# Altium schematic sheet 16-BitSWStatusLed.SchDoc
size A4
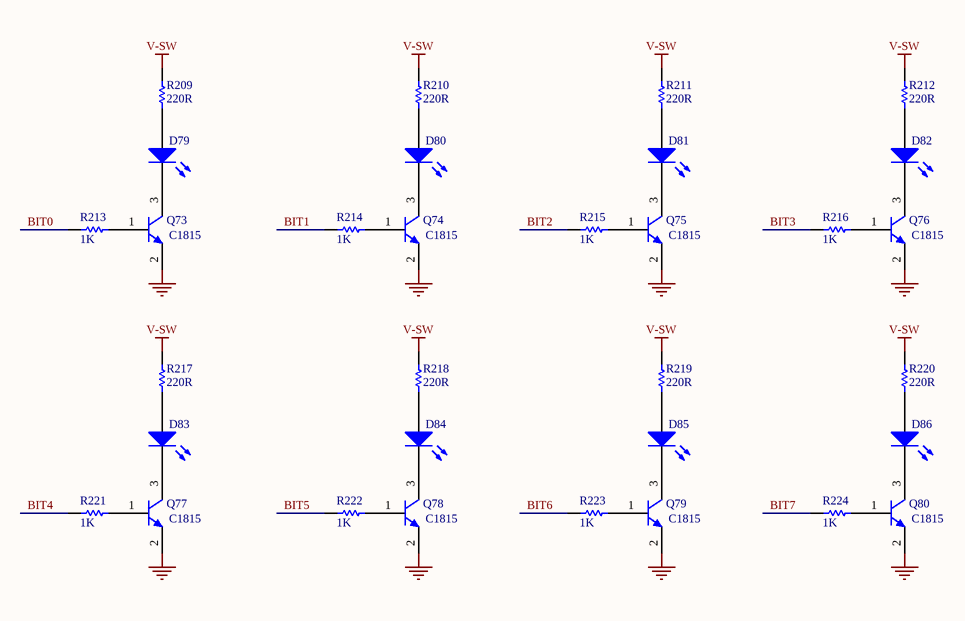
[diagram p0: 16-BitSWStatusLed.SchDoc]

## Parts
D79  LED  [LED-3528]  (value not drawn)
D80  LED  [LED-3528]  (value not drawn)
D81  LED  [LED-3528]  (value not drawn)
D82  LED  [LED-3528]  (value not drawn)
D83  LED  [LED-3528]  (value not drawn)
D84  LED  [LED-3528]  (value not drawn)
D85  LED  [LED-3528]  (value not drawn)
D86  LED  [LED-3528]  (value not drawn)
Q73  value C1815  [SOT23-321]  (hidden comment: C1815-SMD)
Q74  value C1815  [SOT23-321]  (hidden comment: C1815-SMD)
Q75  value C1815  [SOT23-321]  (hidden comment: C1815-SMD)
Q76  value C1815  [SOT23-321]  (hidden comment: C1815-SMD)
Q77  value C1815  [SOT23-321]  (hidden comment: C1815-SMD)
Q78  value C1815  [SOT23-321]  (hidden comment: C1815-SMD)
Q79  value C1815  [SOT23-321]  (hidden comment: C1815-SMD)
Q80  value C1815  [SOT23-321]  (hidden comment: C1815-SMD)
R209  value 220R  [R-0805]  (hidden comment: 221)
R210  value 220R  [R-0805]  (hidden comment: 221)
R211  value 220R  [R-0805]  (hidden comment: 221)
R212  value 220R  [R-0805]  (hidden comment: 221)
R213  1K  [R-0805]
R214  1K  [R-0805]
R215  1K  [R-0805]
R216  1K  [R-0805]
R217  value 220R  [R-0805]  (hidden comment: 221)
R218  value 220R  [R-0805]  (hidden comment: 221)
R219  value 220R  [R-0805]  (hidden comment: 221)
R220  value 220R  [R-0805]  (hidden comment: 221)
R221  1K  [R-0805]
R222  1K  [R-0805]
R223  1K  [R-0805]
R224  1K  [R-0805]

## Nets
GND: Q73.2(E) Q74.2(E) Q75.2(E) Q76.2(E) Q77.2(E) Q78.2(E) Q79.2(E) Q80.2(E)
V-SW: R209.2 R210.2 R211.2 R212.2 R217.2 R218.2 R219.2 R220.2
BIT0: R213.2
BIT1: R214.2
BIT2: R215.2
BIT3: R216.2
BIT4: R221.2
BIT5: R222.2
BIT6: R223.2
BIT7: R224.2
NetD79_1: D79.1(A) R209.1
NetD79_2: D79.2(K) Q73.3(C)
NetD80_1: D80.1(A) R210.1
NetD80_2: D80.2(K) Q74.3(C)
NetD81_1: D81.1(A) R211.1
NetD81_2: D81.2(K) Q75.3(C)
NetD82_1: D82.1(A) R212.1
NetD82_2: D82.2(K) Q76.3(C)
NetD83_1: D83.1(A) R217.1
NetD83_2: D83.2(K) Q77.3(C)
NetD84_1: D84.1(A) R218.1
NetD84_2: D84.2(K) Q78.3(C)
NetD85_1: D85.1(A) R219.1
NetD85_2: D85.2(K) Q79.3(C)
NetD86_1: D86.1(A) R220.1
NetD86_2: D86.2(K) Q80.3(C)
NetQ73_1: Q73.1(B) R213.1
NetQ74_1: Q74.1(B) R214.1
NetQ75_1: Q75.1(B) R215.1
NetQ76_1: Q76.1(B) R216.1
NetQ77_1: Q77.1(B) R221.1
NetQ78_1: Q78.1(B) R222.1
NetQ79_1: Q79.1(B) R223.1
NetQ80_1: Q80.1(B) R224.1

## Library data of the parts
D79-D86 = LED2: Typical RED, GREEN, YELLOW, AMBER GaAs LED; Published: 8-Jun-2000; LatestRevisionDate: 17-Jul-2002; LatestRevisionNote: Re-released for DXP Platform.; PackageVersion: Feb-2002; PackageReference: 3.2X1.6X1.1; Publisher: Altium Limited; PackageDescription: SM LED; 2 Flat Leads
Q73-Q80 = NPN: NPN Bipolar Transistor; Published: 8-Jun-2000; LatestRevisionDate: 17-Jul-2002; LatestRevisionNote: Re-released for DXP Platform.; PackageReference: TO-226-AA; PackageDescription: TO, Flat Index; 3 In-Line, Axial Leads; Body Dia. 4.8mm; Leads 0.55 x 0.51 mm (max); Code_JEDEC: TO-226-AA
R209-R224 = Res1: Resistor; Published: 8-Jun-2000; LatestRevisionDate: 17-Jul-2002; LatestRevisionNote: Re-released for DXP Platform.; PackageReference: AXIAL-0.3; Publisher: Altium Limited; PackageDescription: Axial Device, Thru-Hole; 2 Leads; 0.3 in Pin Spacing
  R213-R216 R221-R224: Value: 1K